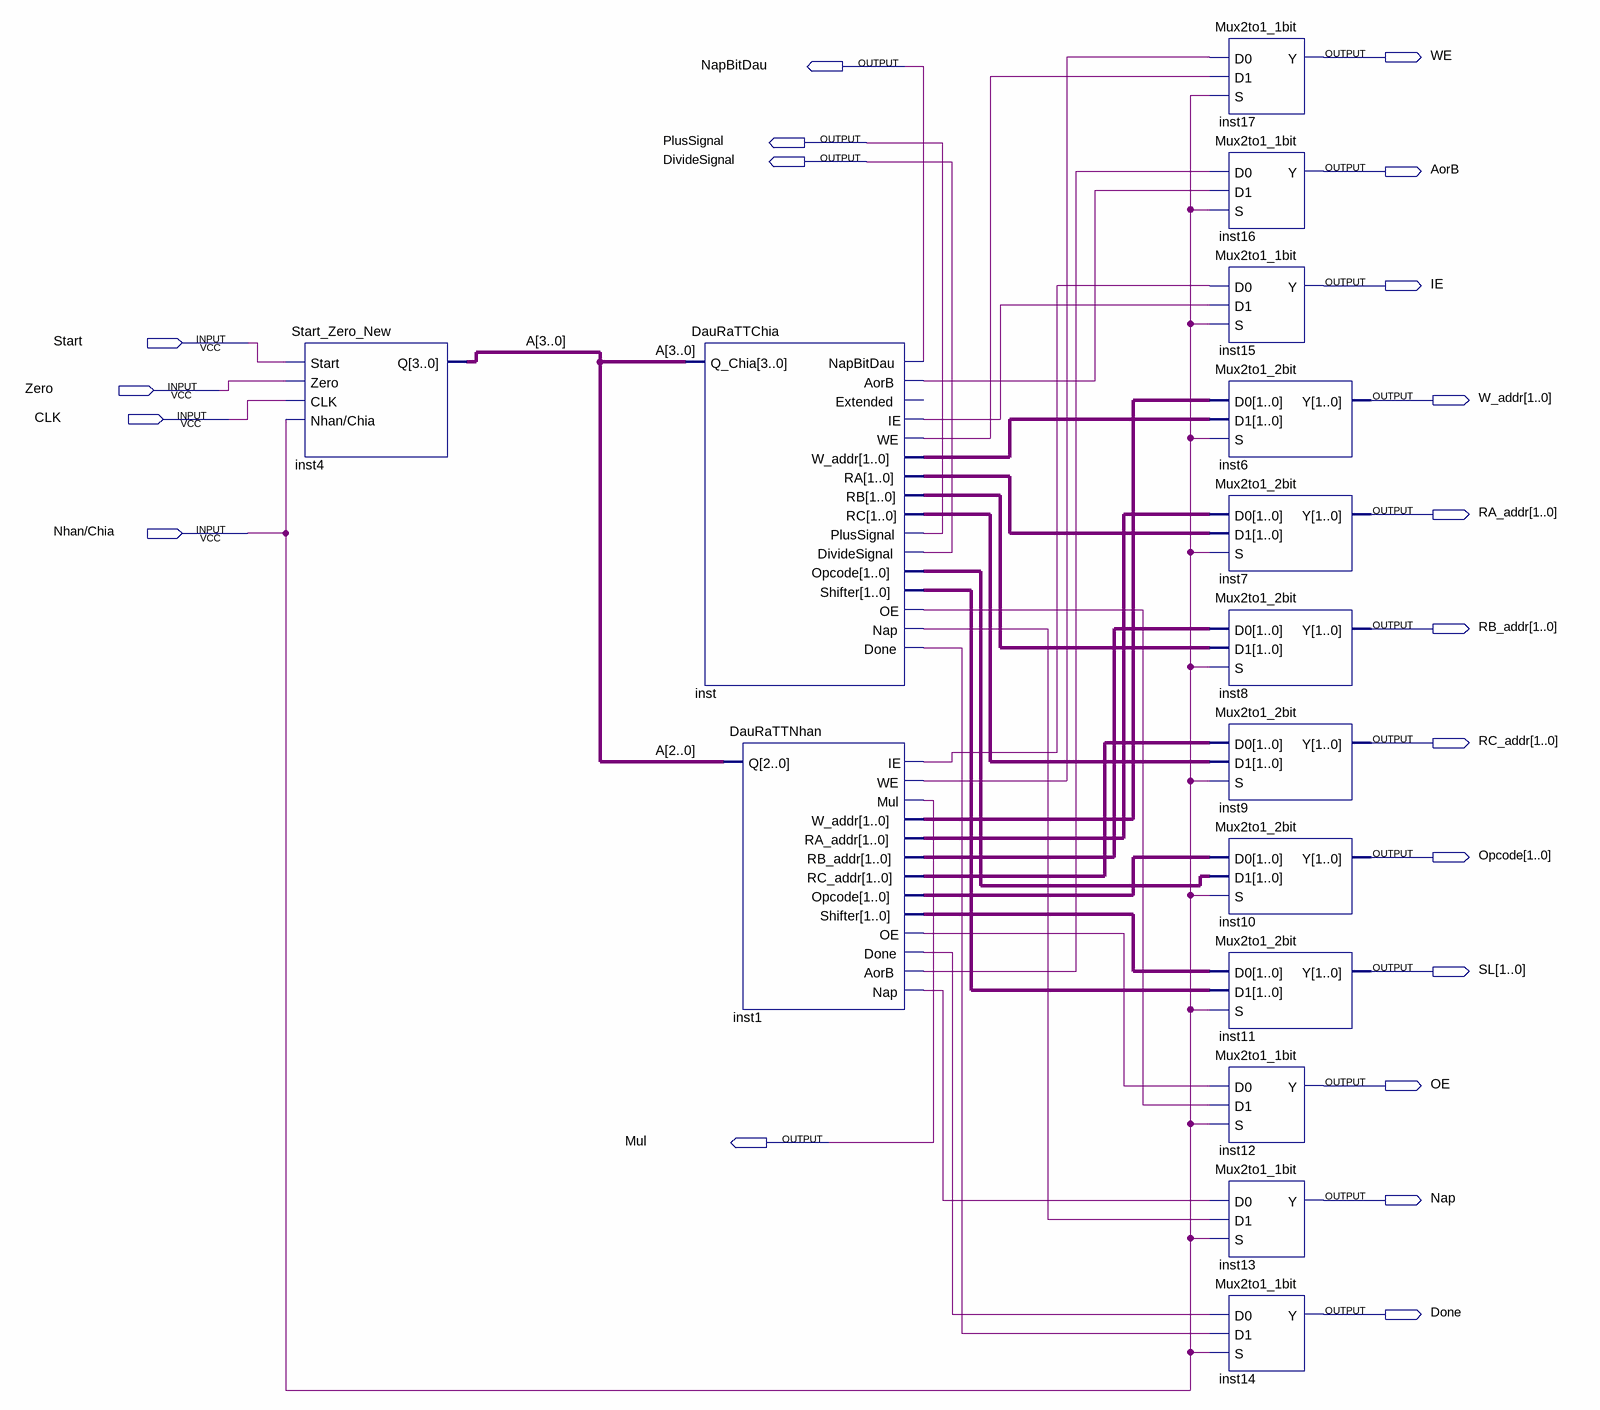
[diagram p0: schematic sheet]
// Quartus schematic Control.bdf as structural Verilog: 15 symbols, 20 pins
module Control (
  input  Start,
  input  Zero,
  input  CLK,
  input  \Nhan/Chia ,
  output WE,
  output NapBitDau,
  output PlusSignal,
  output DivideSignal,
  output AorB,
  output IE,
  output [1:0] W_addr,
  output [1:0] RA_addr,
  output [1:0] RB_addr,
  output [1:0] RC_addr,
  output [1:0] Opcode,
  output [1:0] SL,
  output OE,
  output Mul,
  output Nap,
  output Done
);

  wire inst1_aorb, inst1_done, inst1_ie, inst1_nap, inst1_oe, inst1_we, inst_aorb, inst_done, inst_ie,
       inst_nap, inst_oe, inst_we;
  wire [1:0] inst1_opcode, inst1_ra_addr, inst1_rb_addr, inst1_rc_addr, inst1_shifter, inst1_w_addr,
       inst_opcode, inst_ra, inst_rb, inst_rc, inst_shifter, inst_w_addr;
  wire [3:0] A;

  Start_Zero_New inst4 (.Start(Start), .Zero(Zero), .CLK(CLK), .\Nhan/Chia (\Nhan/Chia ), .Q(A));
  DauRaTTChia inst (
    .Q_Chia(A), .NapBitDau(NapBitDau), .AorB(inst_aorb), .IE(inst_ie), .WE(inst_we), .W_addr(inst_w_addr),
    .RA(inst_ra), .RB(inst_rb), .RC(inst_rc), .PlusSignal(PlusSignal), .DivideSignal(DivideSignal),
    .Opcode(inst_opcode), .Shifter(inst_shifter), .OE(inst_oe), .Nap(inst_nap), .Done(inst_done));  // open: Extended
  DauRaTTNhan inst1 (
    .Q(A[2:0]), .IE(inst1_ie), .WE(inst1_we), .Mul(Mul), .W_addr(inst1_w_addr), .RA_addr(inst1_ra_addr),
    .RB_addr(inst1_rb_addr), .RC_addr(inst1_rc_addr), .Opcode(inst1_opcode), .Shifter(inst1_shifter),
    .OE(inst1_oe), .Done(inst1_done), .AorB(inst1_aorb), .Nap(inst1_nap));
  Mux2to1_1bit inst17 (.D0(inst1_we), .D1(inst_we), .S(\Nhan/Chia ), .Y(WE));
  Mux2to1_1bit inst16 (.D0(inst1_aorb), .D1(inst_aorb), .S(\Nhan/Chia ), .Y(AorB));
  Mux2to1_1bit inst15 (.D0(inst1_ie), .D1(inst_ie), .S(\Nhan/Chia ), .Y(IE));
  Mux2to1_2bit inst6 (.D0(inst1_w_addr), .D1(inst_w_addr), .S(\Nhan/Chia ), .Y(W_addr));
  Mux2to1_2bit inst7 (.D0(inst1_ra_addr), .D1(inst_ra), .S(\Nhan/Chia ), .Y(RA_addr));
  Mux2to1_2bit inst8 (.D0(inst1_rb_addr), .D1(inst_rb), .S(\Nhan/Chia ), .Y(RB_addr));
  Mux2to1_2bit inst9 (.D0(inst1_rc_addr), .D1(inst_rc), .S(\Nhan/Chia ), .Y(RC_addr));
  Mux2to1_2bit inst10 (.D0(inst1_opcode), .D1(inst_opcode), .S(\Nhan/Chia ), .Y(Opcode));
  Mux2to1_2bit inst11 (.D0(inst1_shifter), .D1(inst_shifter), .S(\Nhan/Chia ), .Y(SL));
  Mux2to1_1bit inst12 (.D0(inst1_oe), .D1(inst_oe), .S(\Nhan/Chia ), .Y(OE));
  Mux2to1_1bit inst13 (.D0(inst1_nap), .D1(inst_nap), .S(\Nhan/Chia ), .Y(Nap));
  Mux2to1_1bit inst14 (.D0(inst1_done), .D1(inst_done), .S(\Nhan/Chia ), .Y(Done));
endmodule
